# EAGLE design Callisto_LSOx10_v1p2 (EAGLE 9.6.2)
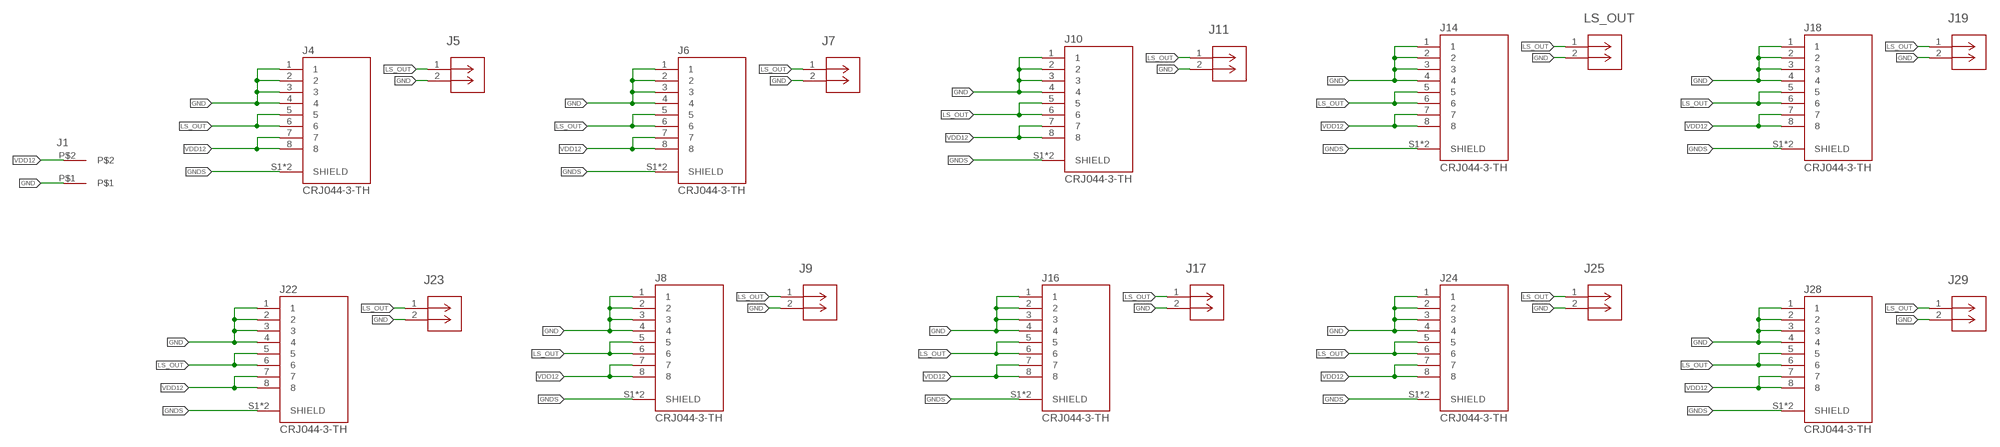
[diagram p0: schematic, sheet 1]

## Parts
J1  2-pos  3.81MM_1_X_2_RT_ANGLE_PLUG_HEADER  [2_3.81MM_PITCH]
J4  CRJ044-3-TH  [CUI_CRJ044-3-TH]
J5  CONN_530470210_PICOBLADE_X_2  [CON_530470210_MOL]
J6  CRJ044-3-TH  [CUI_CRJ044-3-TH]
J7  CONN_530470210_PICOBLADE_X_2  [CON_530470210_MOL]
J8  CRJ044-3-TH  [CUI_CRJ044-3-TH]
J9  CONN_530470210_PICOBLADE_X_2  [CON_530470210_MOL]
J10  CRJ044-3-TH  [CUI_CRJ044-3-TH]
J11  CONN_530470210_PICOBLADE_X_2  [CON_530470210_MOL]
J14  CRJ044-3-TH  [CUI_CRJ044-3-TH]
J16  CRJ044-3-TH  [CUI_CRJ044-3-TH]
J17  CONN_530470210_PICOBLADE_X_2  [CON_530470210_MOL]
J18  CRJ044-3-TH  [CUI_CRJ044-3-TH]
J19  CONN_530470210_PICOBLADE_X_2  [CON_530470210_MOL]
J22  CRJ044-3-TH  [CUI_CRJ044-3-TH]
J23  CONN_530470210_PICOBLADE_X_2  [CON_530470210_MOL]
J24  CRJ044-3-TH  [CUI_CRJ044-3-TH]
J25  CONN_530470210_PICOBLADE_X_2  [CON_530470210_MOL]
J28  CRJ044-3-TH  [CUI_CRJ044-3-TH]
J29  CONN_530470210_PICOBLADE_X_2  [CON_530470210_MOL]
LS_OUT  CONN_530470210_PICOBLADE_X_2  [CON_530470210_MOL]

## Nets
GND: J1.P$1 J4.1 J4.2 J4.3 J4.4 J5.2 J6.1 J6.2 J6.3 J6.4 J7.2 J8.1 J8.2 J8.3 J8.4 J9.2 J10.1 J10.2 J10.3 J10.4 J11.2 J14.1 J14.2 J14.3 J14.4 J16.1 J16.2 J16.3 J16.4 J17.2 J18.1 J18.2 J18.3 J18.4 J19.2 J22.1 J22.2 J22.3 J22.4 J23.2 J24.1 J24.2 J24.3 J24.4 J25.2 J28.1 J28.2 J28.3 J28.4 J29.2 LS_OUT.2
GNDS: J4.S1(SHIELD) J4.S2(SHIELD) J6.S1(SHIELD) J6.S2(SHIELD) J8.S1(SHIELD) J8.S2(SHIELD) J10.S1(SHIELD) J10.S2(SHIELD) J14.S1(SHIELD) J14.S2(SHIELD) J16.S1(SHIELD) J16.S2(SHIELD) J18.S1(SHIELD) J18.S2(SHIELD) J22.S1(SHIELD) J22.S2(SHIELD) J24.S1(SHIELD) J24.S2(SHIELD) J28.S1(SHIELD) J28.S2(SHIELD)
LS_OUT: J4.5 J4.6 J5.1 J6.5 J6.6 J7.1 J8.5 J8.6 J9.1 J10.5 J10.6 J11.1 J14.5 J14.6 J16.5 J16.6 J17.1 J18.5 J18.6 J19.1 J22.5 J22.6 J23.1 J24.5 J24.6 J25.1 J28.5 J28.6 J29.1 LS_OUT.1
VDD12: J1.P$2 J4.7 J4.8 J6.7 J6.8 J8.7 J8.8 J10.7 J10.8 J14.7 J14.8 J16.7 J16.8 J18.7 J18.8 J22.7 J22.8 J24.7 J24.8 J28.7 J28.8

## Library data of the parts
J1 = 3D_MIG_Controller:3.81MM_1_X_2_RT_ANGLE_PLUG_HEADER: TERM BLOCK HDR 2POS 90DEG 3.81MM; PARTNO: 691322310002
J4 J6 J8 J10 J14 J16 J18 J22 J24 J28 = 3D_MIG_Controller:CRJ044-3-TH: Modular Jack; MAXIMUM_PACKAGE_HEIGHT: 13.46 mm; PARTREV: 1.0; STANDARD: Manufacturer Recommendations
J5 J7 J9 J11 J17 J19 J23 J25 J29 LS_OUT = 3D_MIG_Controller:CONN_530470210_PICOBLADE_X_2; COPYRIGHT: Copyright (C) 2022 Ultra Librarian. All rights reserved.; MANUFACTURER_PART_NUMBER: 530470210; MFR_NAME: Molex Connector Corporation

## Board
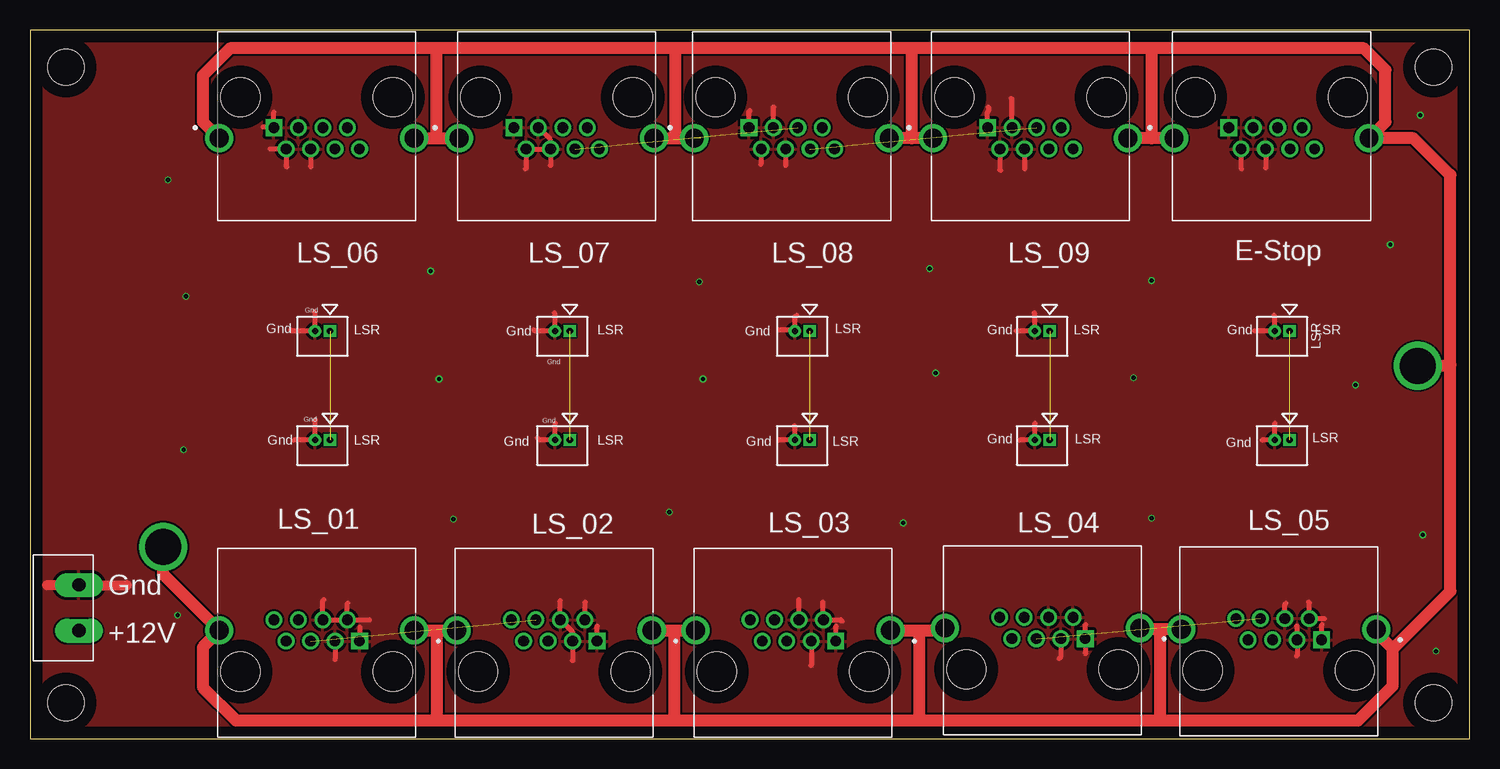
[diagram p1: board, top side]
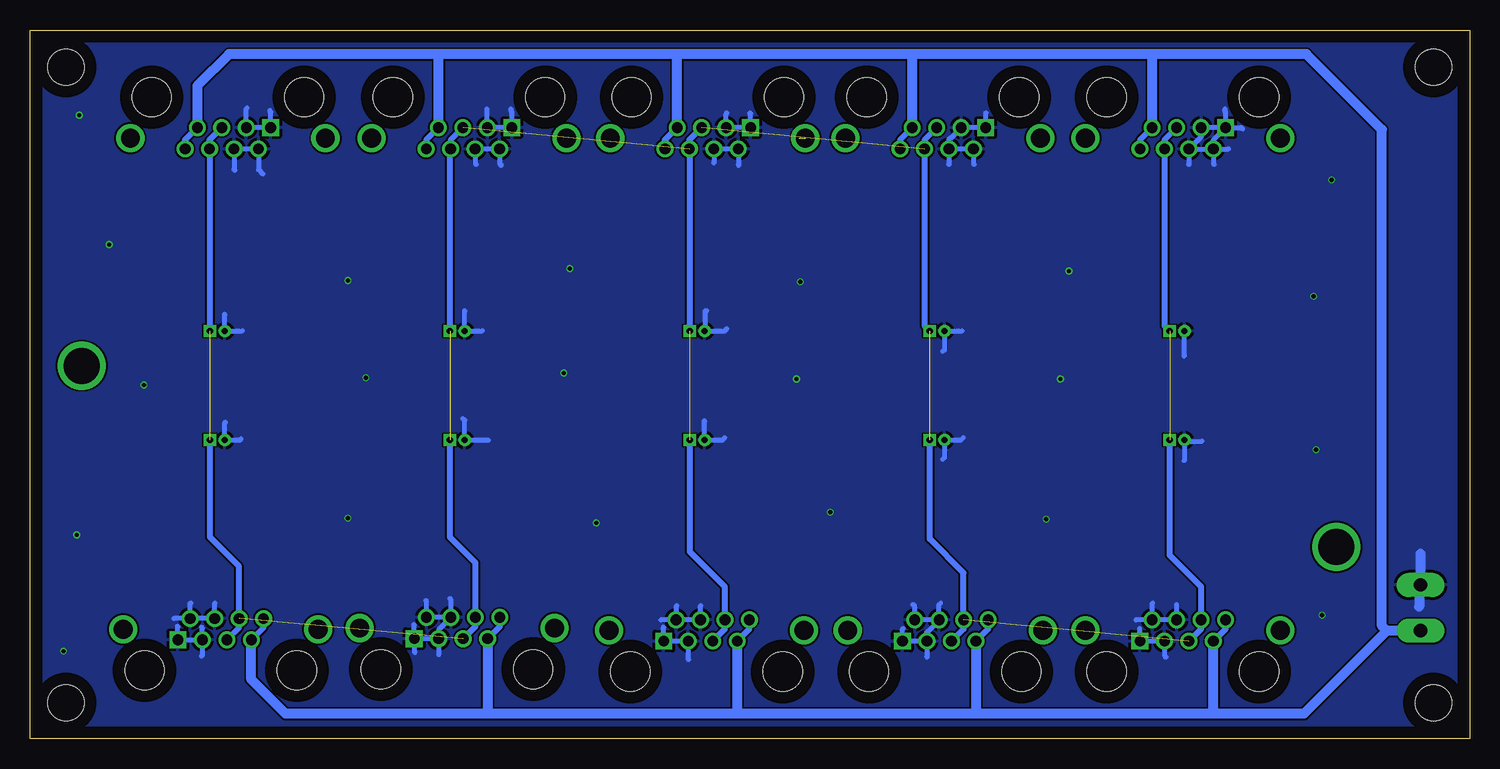
[diagram p2: board, bottom side, seen from below]

Size 120 x 59.1 mm. Coordinates in mm from the lower left corner, seen from the top.
Outline: 0,0 120,0 120,59.1 0,59.1 0,0
Copper layers (1*16): Top 0.035mm / dielectric 1.5mm / Bottom 0.035mm
Design rules "default": minimum track width 6mil, minimum drill 0.2mm, track to track 6mil, track to pad 6mil, pad to pad 6mil, via to via 6mil, smd to smd 6mil, copper to edge 40mil, drill to drill 6mil, minimum pad ring 10mil, minimum via ring 4mil, stop-mask expansion 4mil, vias tented up to drill 0mil, thermal gap 10mil
Holes 3 mm at 3,3 117,3 3,56 117,56

### Footprints (pad centres in the part's own frame; a part is rotated, then mirrored left to right if it is on the bottom)
2_3.81MM_PITCH = drill 1.1 pad 2 long: P$1 0,0; P$2 3.81,0
CUI_CRJ044-3-TH = drill 0.89 square: 1 3.57,2.54 | drill 0.89: 2 2.55,4.32; 3 1.53,2.54; 4 0.51,4.32; 5 -0.51,2.54; 6 -1.53,4.32; 7 -2.55,2.54; 8 -3.57,4.32 | drill 1.57: S1 8.13,3.43; S2 -8.13,3.43 | hole 3.25: -6.35,0; 6.35,0
CON_530470210_MOL = drill 0.508 pad 0.838 square: 1 0,0 | drill 0.508 pad 0.838: 2 -1.245,0

### Placement (x,y rotation side)
J1  4.08,12.82 270 top
J4  23.9,5.6 0 top
J5  25,24.9 0 top
J6  43.7,5.6 0 top
J7  45,24.9 0 top
J8  43.9,53.5 180 top
J9  45,34 0 top
J10  63.6,5.6 0 top
J11  65,24.9 0 top
J14  84.4,5.8 0 top
J16  63.5,53.5 180 top
J17  65,34 0 top
J18  104.1,5.7 0 top
J19  105,24.9 0 top
J22  23.9,53.5 180 top
J23  25,34 0 top
J24  83.4,53.5 180 top
J25  85,34 0 top
J28  103.5,53.5 180 top
J29  105,34 0 top
LS_OUT  85,24.9 0 top

### Tracks (layer width: path | path; a pad name or v marks a point on that pad's centre or on a via)
GND  (via drill 0.35)
  Top 0.406: 22,24.9 J5.2 23.75,26.55 23.8,26.6 | 21.7,34.1 21.8,34 J23.2 23.75,35.55 23.7,35.6 | 20,49.2 20.02,49.18 J22.2 21.35,47.75 21.4,47.7 | J22.4 23.39,47.71 23.4,47.7 | 20.34,52.26 20.33,52.26 J22.1 20.29,51 19.4,51 | 43.39,49.2 J8.4 43.39,47.81 43.4,47.8 | 43.39,49.2 43.39,49.94 J8.3 | 43.39,49.2 43.37,49.18 J8.2 41.35,47.55 41.3,47.5 | J28.2 100.95,47.55 101,47.5 | J28.4 103,47.6 | J24.4 82.9,47.5 | J24.2 80.85,47.45 80.9,47.4 | J24.3 81.87,53.33 81.8,53.4 | J24.1 79.83,52.26 79.89,52.32 79.89,52.7 | J16.1 59.93,52.26 59.99,52.32 59.99,52.39 60,52.4 | J16.3 61.97,52.67 62,52.7 | J16.2 60.95,47.95 60.9,47.9 | J16.4 62.99,47.81 63,47.8 | 24.5,11.6 24.41,11.51 J4.4 J4.2 | J4.2 26.45,11.25 26.5,11.3 | J4.2 28.28,9.92 28.3,9.9 | J4.1 27.5,8.17 27.5,9.3 | J4.3 25.43,6.63 25.4,6.6 | 44.2,11.5 J6.4 45.23,8.9 J6.3 45.23,6.53 45.2,6.5 | J6.2 46.25,11.35 46.3,11.4 | J6.1 47.27,9.37 47.3,9.4 | J10.4 64.1,11.6 | 66.1,11.4 66.1,9.97 J10.2 67.58,9.92 67.7,9.8 | J10.3 65.13,6.13 65.1,6.1 | J10.1 67.17,9.37 67.2,9.4 | J14.3 85.93,6.83 85.8,6.7 | 88,7.1 87.97,7.13 J14.1 87.97,9.47 88,9.5 | 105.6,6.9 105.63,6.93 J18.3 105.63,9.37 105.6,9.4 | J18.4 104.61,11.21 104.7,11.3 | 106.6,11.4 106.65,11.35 J18.2 107.88,10.02 107.9,10 | J18.1 107.67,9.47 107.7,9.5 | 102.7,24.9 J19.2 103.75,26.25 103.8,26.3 | 82.5,24.9 LS_OUT.2 83.75,26.25 83.8,26.3 | 103.7,35.3 103.75,35.24 J29.2 102.1,34 | 83.7,35.5 83.75,35.45 J25.2 82.2,34 | 62.4,24.9 J11.2 63.76,26.05 63.7,26.1 | 62.4,34.1 63.66,34.1 J17.2 63.76,35.16 63.9,35.3 | 43.7,35.5 43.76,35.45 J9.2 42.1,34 42,34.1 | 43.8,26.3 43.76,26.25 J7.2 42.5,24.9 42.3,25.1
  Top 0.813: 8.1,12.8 4.1,12.8 J1.P$1 4.06,12.8 1.42,12.8
  Bottom 0.406: 22.3,24.8 23.66,24.8 J5.2 23.75,23.25 23.8,23.2 | 43.9,32.3 43.76,32.45 J9.2 42.3,34 | 43.9,23.3 43.76,23.45 J7.2 42.4,24.9 42.2,25.1 | 63.8,26.5 63.76,26.45 J11.2 62.3,24.9 62.1,25.1 | 63.6,35.7 63.7,35.7 63.7,34.05 J17.2 62.1,34 61.9,34.2 | 81.8,24.9 LS_OUT.2 83.75,26.55 83.9,26.7 | 82.3,34 J25.2 83.75,35.66 83.8,35.7 | 102.4,25 102.5,24.9 J19.2 103.75,26.34 103.7,26.4 | 103.8,35.4 103.75,35.35 J29.2 102.3,34 | 100.6,47.1 100.95,47.45 J28.2 J28.4 102.99,47.49 102.9,47.4 | 101.9,52.6 101.97,52.53 J28.3 J28.1 99.93,52.26 99.99,52.32 99.99,52.4 | 79.9,52.5 79.89,52.49 79.89,52.32 79.83,52.26 J24.1 J24.3 81.9,50.99 81.9,52.5 | 80.7,47.8 80.85,47.95 J24.2 J24.4 82.89,47.99 82.8,47.9 | 60,52.2 59.93,52.13 J16.1 J16.3 61.97,52.13 61.9,52.2 | 60.9,47.8 60.95,47.85 J16.2 J16.4 62.99,48.01 63,48 | 40.3,52.2 40.33,52.17 J8.1 J8.3 43.32,50.01 43.39,50.01 | J8.4 43.39,47.91 43.4,47.9 | 41.3,47.9 41.35,47.95 J8.2 J8.4 | J8.4 43.39,50.01 | 43.39,50.01 43.3,50.1 | J22.1 19.03,50.96 18.94,50.86 | J22.1 20.33,52.26 20.39,52.32 20.39,52.5 | J22.1 J22.3 22.37,50.2 J22.4 | J22.4 23.39,47.91 23.4,47.9 | J22.4 J22.2 | J22.2 21.35,47.95 21.3,47.9 | J22.2 20.12,49.18 20.1,49.2 | J22.2 21.35,49.94 J22.1 | 24.4,11.2 24.41,11.19 J4.4 27.78,9.92 27.8,9.9 | J4.2 26.45,11.25 26.4,11.3 | 25.3,6.8 25.43,6.93 J4.3 J4.1 27.5,8.17 27.5,9.2 | J6.4 44.21,11.19 44.1,11.3 | J6.4 J6.2 46.25,11.05 46.4,11.2 | J6.3 45.23,6.83 45.2,6.8 | J6.3 J6.1 47.27,9.13 47.2,9.2 | J6.4 45.2,8.93 | 45.2,8.93 45.2,8.9 | 45.2,8.93 45.23,8.9 J6.3 | 64.1,11.1 J10.4 J10.2 | J10.2 67.38,9.92 67.4,9.9 | J10.2 66.1,9.97 66.1,11.1 | 65.1,6.6 65.13,6.63 J10.3 J10.1 67.17,9.27 67.2,9.3
  Bottom 0.406: J14.4 84.91,11.61 85,11.7 | J14.4 J14.2 86.95,11.45 87,11.5 | J14.3 85.93,7.03 85.9,7 | J14.3 J14.1 | J14.1 87.97,9.47 88,9.5 | J14.1 87.97,7.27 87.9,7.2 | J14.4 85.93,9.1 J14.3 | 104.6,11.3 J18.4 J18.2 | J18.2 106.65,11.25 106.6,11.3 | J18.2 107.98,10.02 108,10 | 107.7,9.4 107.67,9.37 J18.1 J18.3 | J18.3 105.63,9.23 105.7,9.3 | J18.3 105.63,6.97 105.7,6.9 | J23.2 23.8,33.95 23.8,31.9 23.75,31.95 J23.2
  Bottom 0.813: 4.08,15.42 J1.P$1 4.2,12.7 4.2,11
  other vias: 12.3,10.3 35.3,18.3 53.3,18.9 72.8,18 75.5,30.5 56.1,30 34.1,30 12.8,24.1 13,36.9 33.4,39 55.8,38.1 75,39.2 93.5,18.4 92,30.1 93.5,38.2 116.1,17 110.5,29.5 113.4,41.2 11.5,46.6 117.2,7.3 115.9,52
  pour Bottom: 0,59.1 120,59.1 120,0 0,0
  pour Top: 0,59.1 120,59.1 120,0 0,0
GNDS  (via drill 3)  (1 unrouted)
  Top 1.016: 113.6,7.5 113.6,4.4 110.73,1.52 94.2,1.52 | 113.6,7.5 112.23,8.87 J18.S1 | 33.8,1.52 17.17,1.52 14.4,4.3 14.4,7.6 15.77,8.97 J4.S2 11.1,13.7 v11.1,16 | 33.8,1.52 53.6,1.52 | 53.6,1.52 74,1.52 | 74,1.52 94.2,1.52 | J18.S2 94.2,9.13 | 94.2,9.13 92.63,9.13 J14.S1 | 94.2,9.13 94.2,1.52 | J4.S1 33.9,9.03 | 33.9,9.03 J6.S2 | J6.S1 53.7,9.03 | 53.7,9.03 J10.S2 | J10.S1 74.1,9.03 | 74.1,9.03 76.07,9.03 J14.S2 | 74.1,9.03 74.1,1.62 74,1.52 | 53.7,9.03 53.7,1.62 53.6,1.52 | 33.9,9.03 33.9,1.62 33.8,1.52 | 113.6,7.5 118.4,12.3 118.4,31.2 | 118.4,31.2 118.4,47 115.33,50.07 J28.S2 112.99,51.43 113,51.43 113,55.78 111.2,57.58 93.4,57.58 | 93.4,57.58 73.4,57.58 | 73.4,57.58 53.7,57.58 | 53.7,57.58 34,57.58 | 34,57.58 16.68,57.58 14.4,55.3 14.4,51.44 J22.S1 | J22.S2 33.9,50.07 | 33.9,50.07 J8.S1 | J8.S2 53.8,50.07 | 53.8,50.07 55.87,50.07 55.9,50.1 | J28.S1 93.5,50.07 | 93.5,50.07 J24.S2 | J24.S1 73.5,50.07 | 73.5,50.07 J16.S2 | 53.8,50.07 53.8,57.48 53.7,57.58 | 73.5,50.07 73.5,57.48 73.4,57.58 | 93.5,50.07 93.5,57.48 93.4,57.58 | 33.9,50.07 33.9,57.48 34,57.58 | 118.4,31.2 118.3,31.1 v115.7,31.1
LS_OUT  (9 unrouted)
  Bottom 0.508: J4.5 22.37,9.16 J4.6 22.37,12.67 25,15.3 J5.1 | J6.5 42.17,9.16 J6.6 42.17,13.81 45,16.64 J7.1 | J10.5 62.07,9.16 J10.6 62.07,12.67 65,15.6 J11.1 | J14.5 82.87,9.36 J14.6 82.87,14.67 85,16.8 LS_OUT.1 | J18.5 102.57,9.26 J18.6 102.57,14.37 105,16.8 J19.1 | J22.5 25.43,49.94 J22.6 25.43,34.43 J23.1 | J8.5 45.43,49.94 J8.6 45.43,34.43 J9.1 | J16.5 65.03,49.94 J16.6 65.03,34.03 J17.1 | J24.5 84.93,49.94 J24.6 85,49.11 J25.1 | J28.5 105.03,49.94 J28.6 105,49.15 J29.1
VDD12
  Bottom 0.508: J4.7 20.33,9.16 J4.8 20.33,9.95 | J6.7 40.13,9.16 J6.8 40.13,9.95 | J10.7 60.03,9.16 J10.8 60.03,9.95 | J14.7 80.83,9.36 J14.8 80.83,10.15 | J18.7 100.53,9.26 J18.8 100.53,10.05 | J22.7 27.47,49.94 J22.8 27.47,49.15 | J8.7 47.47,49.94 J8.8 47.47,49.15 | J16.7 67.07,49.94 J16.8 67.07,49.15 | J24.7 86.97,49.94 J24.8 86.97,49.15 | J28.7 107.07,49.94 J28.8 107.07,49.15
  Bottom 0.813: 21.1,2.1 41.1,2.1 | 41.1,2.1 61.1,2.1 | 61.1,2.1 81.9,2.1 | 81.9,2.1 98.7,2.1 101.55,4.95 J18.7 | 21.1,2.1 21.35,2.35 J4.7 | J6.7 41.15,2.15 41.1,2.1 | J10.7 61.05,2.15 61.1,2.1 | J14.7 81.85,2.15 81.9,2.1 | J28.7 106.06,54.45 103.4,57.1 86,57.1 | 26.3,57.1 13.6,57.1 7.3,50.8 7.3,9.42 6.89,9.01 | 26.3,57.1 46.3,57.1 | 46.3,57.1 66,57.1 | 66,57.1 86,57.1 | J22.7 26.45,56.95 26.3,57.1 | J8.7 46.45,56.95 46.3,57.1 | J16.7 66.05,57.05 66,57.1 | J24.7 85.95,57.05 86,57.1 | 21.1,2.1 13.8,2.1 6.89,9.01 | J1.P$2 6.89,9.01

### Text on the board
tPlace: LS_06 | LS_07 | LS_08 | LS_09 | E-Stop | Gnd | Gnd | LSR | Gnd | LSR | Gnd | LSR | Gnd | LSR | Gnd | LSR | LSR | Gnd | Gnd | Gnd | Gnd | LSR | LSR | Gnd | LSR | Gnd | LSR | Gnd | LSR | Gnd | LS_01 | LS_02 | LS_03 | LS_04 | LS_05 | Gnd | +12V